# Altium schematic sheet hdmi.schdoc: HDMI
size A4; Date: 09.30.2026; CheckedBy: BCY; DrawnBy: miaow; Revision: v1.0.0; SheetNumber: 11; SheetTotal: 18; BoardType: MAIN_PCB; Desc: Micro / Type D
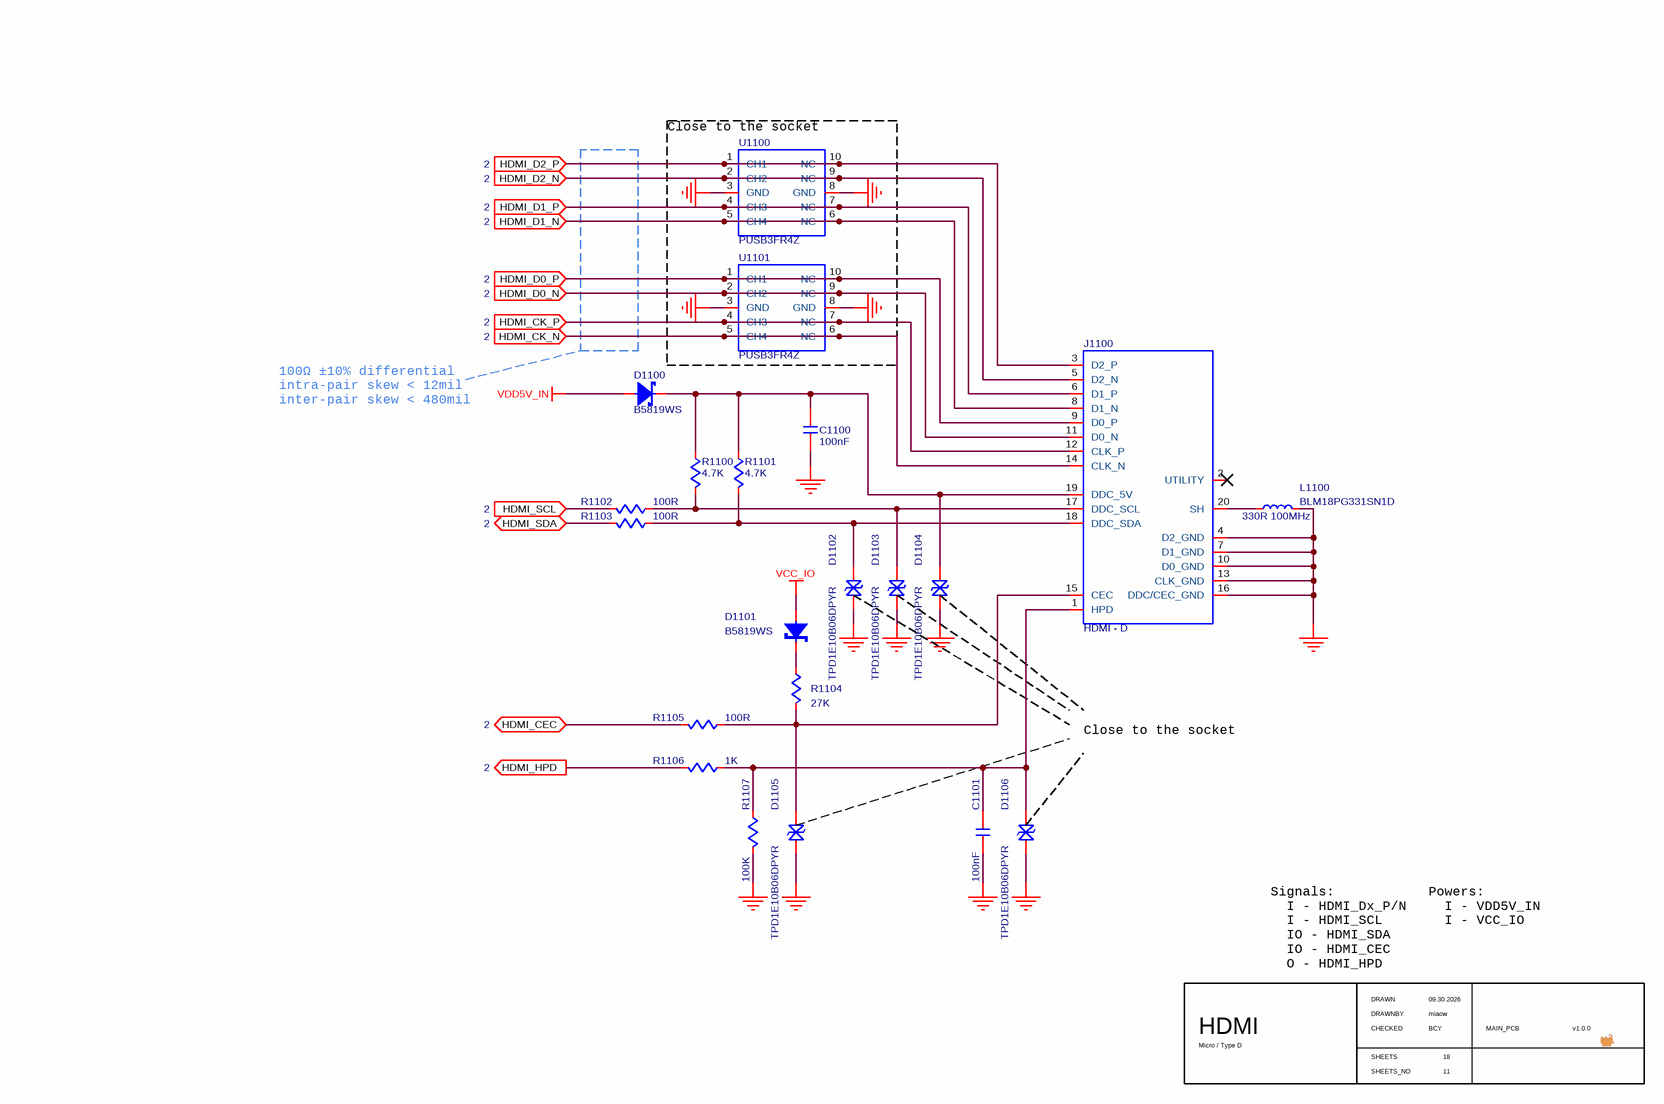
[diagram p0: hdmi.schdoc]

## Parts
C1100  value 100nF  [C0402]  (hidden comment: C-NOMO)
C1101  value 100nF  [C0402]  (hidden comment: C-NOMO)
D1100  B5819WS  [B5819WS]
D1101  B5819WS  [B5819WS]
D1102  TPD1E10B06DPYR  [TPD1E10B06DPYR]
D1103  TPD1E10B06DPYR  [TPD1E10B06DPYR]
D1104  TPD1E10B06DPYR  [TPD1E10B06DPYR]
D1105  TPD1E10B06DPYR  [TPD1E10B06DPYR]
D1106  TPD1E10B06DPYR  [TPD1E10B06DPYR]
J1100  HDMI - D  [HDMI-D]
L1100  BLM18PG331SN1D  value 330R 100MHz  [L0603]
R1100  value 4.7K  [R0402]  (hidden comment: R)
R1101  value 4.7K  [R0402]  (hidden comment: R)
R1102  value 100R  [R0402]  (hidden comment: R)
R1103  value 100R  [R0402]  (hidden comment: R)
R1104  value 27K  [R0402]  (hidden comment: R)
R1105  value 100R  [R0402]  (hidden comment: R)
R1106  value 1K  [R0402]  (hidden comment: R)
R1107  value 100K  [R0402]  (hidden comment: R)
U1100  PUSB3FR4Z  [PUSB3FR4Z]
U1101  PUSB3FR4Z  [PUSB3FR4Z]

## Blocks framed on the sheet
Close to the socket: U1100 U1101

## Ports
HDMI_CEC (bidir, see 2), HDMI_CK_N (in, see 2), HDMI_CK_P (in, see 2), HDMI_D0_N (in, see 2), HDMI_D0_P (in, see 2), HDMI_D1_N (in, see 2), HDMI_D1_P (in, see 2), HDMI_D2_N (in, see 2), HDMI_D2_P (in, see 2), HDMI_HPD (out, see 2), HDMI_SCL (in, see 2), HDMI_SDA (bidir, see 2)

## Nets
GND: C1100.1 C1101.1 D1102.1 D1103.1 D1104.1 D1105.1 D1106.1 J1100.4(D2_GND) J1100.7(D1_GND) J1100.10(D0_GND) J1100.13(CLK_GND) J1100.16(DDC/CEC_GND) L1100.2 R1107.1 U1100.3(GND) U1100.8(GND) U1101.3(GND) U1101.8(GND)
VCC_IO: D1101.2
VDD5V_IN: D1100.2
HDMI_CEC: R1105.1 ; port HDMI_CEC
HDMI_CK_N: J1100.14(CLK_N) U1101.5(CH4) U1101.6(NC) ; port HDMI_CK_N
HDMI_CK_P: J1100.12(CLK_P) U1101.4(CH3) U1101.7(NC) ; port HDMI_CK_P
HDMI_D0_N: J1100.11(D0_N) U1101.2(CH2) U1101.9(NC) ; port HDMI_D0_N
HDMI_D0_P: J1100.9(D0_P) U1101.1(CH1) U1101.10(NC) ; port HDMI_D0_P
HDMI_D1_N: J1100.8(D1_N) U1100.5(CH4) U1100.6(NC) ; port HDMI_D1_N
HDMI_D1_P: J1100.6(D1_P) U1100.4(CH3) U1100.7(NC) ; port HDMI_D1_P
HDMI_D2_N: J1100.5(D2_N) U1100.2(CH2) U1100.9(NC) ; port HDMI_D2_N
HDMI_D2_P: J1100.3(D2_P) U1100.1(CH1) U1100.10(NC) ; port HDMI_D2_P
HDMI_HPD: R1106.1 ; port HDMI_HPD
HDMI_SCL: R1102.1 ; port HDMI_SCL
HDMI_SDA: R1103.1 ; port HDMI_SDA
NetC1100_2: C1100.2 D1100.1 D1104.2 J1100.19(DDC_5V) R1100.2 R1101.2
NetC1101_2: C1101.2 D1106.2 J1100.1(HPD) R1106.2 R1107.2
NetD1101_1: D1101.1 R1104.2
NetD1102_2: D1102.2 J1100.18(DDC_SDA) R1101.1 R1103.2
NetD1103_2: D1103.2 J1100.17(DDC_SCL) R1100.1 R1102.2
NetD1105_2: D1105.2 J1100.15(CEC) R1104.1 R1105.2
NetJ1100_20: J1100.20(SH) L1100.1

Not connected (* = marked no-connect by the designer): J1100 2(UTILITY)*

## Notes on the sheet
- 100Ω ±10% differential
- intra-pair skew < 12mil
- inter-pair skew < 480mil
- Close to the socket
- Signals:
  I - HDMI_Dx_P/N
  I - HDMI_SCL
  IO - HDMI_SDA
  IO - HDMI_CEC
  O - HDMI_HPD
- Powers:
  I - VDD5V_IN
  I - VCC_IO
- DRAWN
- CHECKED
- DRAWNBY
- SHEETS
- SHEETS_NO

## Library data of the parts
C1100 C1101 = C-NOMO: voltage: 50V; precision: 10%; Supplier 1: LCSC; Supplier Part Number 1: C307331
D1100 D1101 = B5819WS: SCHOTTKY; Supplier 1: LCSC; Supplier Part Number 1: C7420331
D1102-D1106 = TPD1E10B06DPYR: TVS/ESD - 1 ch, 5.5V, 6V, 12pF@1MHz, 30KV; Supplier 1: LCSC; Supplier Part Number 1: C48260
J1100 = HDMI: Supplier 1: LCSC; Supplier Part Number 1: C711358
L1100 = L: Code_IEC: 1005; Published: 8-Jun-2000; LatestRevisionDate: 29-May-2009; LatestRevisionNote: IPC-7351 Footprint Added.; PackageReference: 0402-A; Publisher: Altium Limited; PackageDescription: Chip Inductor; Code_JEITA: 0402; Supplier 1: LCSC; Supplier Part Number 1: C79913
R1100-R1107 = R: precision: 1%; Supplier 1: LCSC
  R1100 R1101: Supplier Part Number 1: C25900
  R1102 R1103 R1105: Supplier Part Number 1: C25076
  R1104: Supplier Part Number 1: C25771
  R1106: Supplier Part Number 1: C11702
  R1107: Supplier Part Number 1: C25741
U1100 U1101 = PUSB3FR4Z: TVS/ESD - 4 ch, 3.3V, 5.5V, 0.29pF@1MHz, 15KV; Supplier 1: LCSC; Supplier Part Number 1: C503418